# EAGLE design 1_Channel (EAGLE 9.5.2)
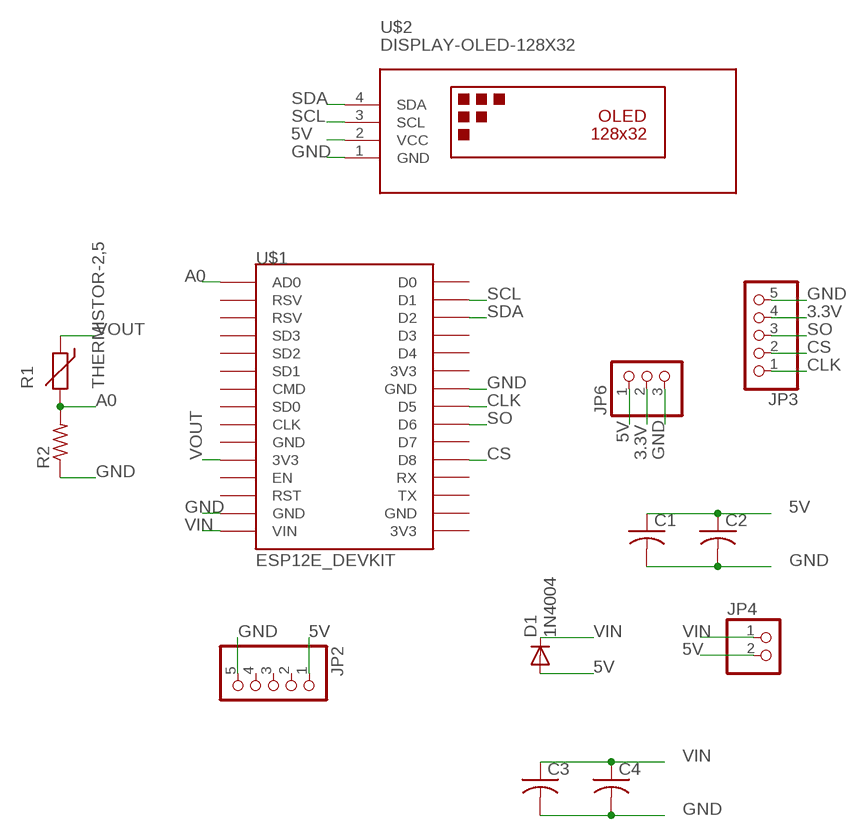
[diagram p0: schematic, sheet 1]

## Parts
C1  C-US050-025X075  [C050-025X075]
C2  C-US050-025X075  [C050-025X075]
C3  C-US050-025X075  [C050-025X075]
C4  C-US050-025X075  [C050-025X075]
D1  1N4004  [DO41-10]
JP2  PINHD-1X5  [1X05]
JP3  PINHD-1X5  [1X05]
JP4  PINHD-1X2  [1X02]
JP6  PINHD-1X3CB  [1X03-CLEANBIG]
R1  THERMISTOR-2,5  [RS-2,5]
R2  R-US_0207/7  [0207/7]
U$1  ESP12E_DEVKIT  [ESP12E_DEVKIT]
U$2  DISPLAY-OLED-128X32  [DISPLAY-OLED-128X32]

## Nets
3.3V: JP3.4 JP6.2
5V: C1.1 C2.1 D1.A JP2.1 JP4.2 JP6.1 U$2.2(VCC)
A0: R1.2 R2.2 U$1.AD0
CLK: JP3.1 U$1.D5
CS: JP3.2 U$1.D8
GND: C1.2 C2.2 C3.2 C4.2 JP2.5 JP3.5 JP6.3 R2.1 U$1.GND@1(GND) U$1.GND@2(GND) U$2.1(GND)
SCL: U$1.D1 U$2.3(SCL)
SDA: U$1.D2 U$2.4(SDA)
SO: JP3.3 U$1.D6
VIN: C3.1 C4.1 D1.C JP4.1 U$1.VIN
VOUT: R1.1 U$1.3V3@0(3V3)
Unconnected: JP2.2 JP2.3 JP2.4 U$1.3V3@1(3V3) U$1.3V3@2(3V3) U$1.CLK U$1.CMD U$1.D0 U$1.D3 U$1.D4 U$1.D7 U$1.EN U$1.GND@0(GND) U$1.GND@3(GND) U$1.RST U$1.RSV@0(RSV) U$1.RSV@1(RSV) U$1.RX U$1.SD0 U$1.SD1 U$1.SD2 U$1.SD3 U$1.TX

## Library data of the parts
C1-C4 = adafruit:C-US: CAPACITOR, American symbol
D1 = adafruit:1N4004: DIODE General purpose 1N400x type rectifier (With bigger pads) http://www.ladyada.net/library/pcb/eaglelibrary.html
JP2 JP3 = pinhead:PINHD-1X5: PIN HEADER
JP4 = pinhead:PINHD-1X2: PIN HEADER
JP6 = adafruit:PINHD-1X3: PIN HEADER
R1 = varistor:THERMISTOR: THERMISTOR
R2 = adafruit:R-US_: RESISTOR, American symbol
U$1 = ESP12E_DEVKIT:ESP12E_DEVKIT: ESP12E DEVKIT BOARD
U$2 = diy-modules:DISPLAY-OLED-128X32: 128x32 Dot Matrix OLED Module with I2C interface based on SSD1306 chip More details available here: http://www.tinyosshop.com/index.php?route=product/product&product_id=953 Schematic available here: http://www.tinyosshop.com/datasheet/OLED%2012832.pdf SSD1306 datasheet: https://cdn-shop.adafruit.com/datasheets/SSD1306.pdf Click here to find device on ebay.com <http://www.ebay.com/sch/oled+display+128x32+i2c>

## Board
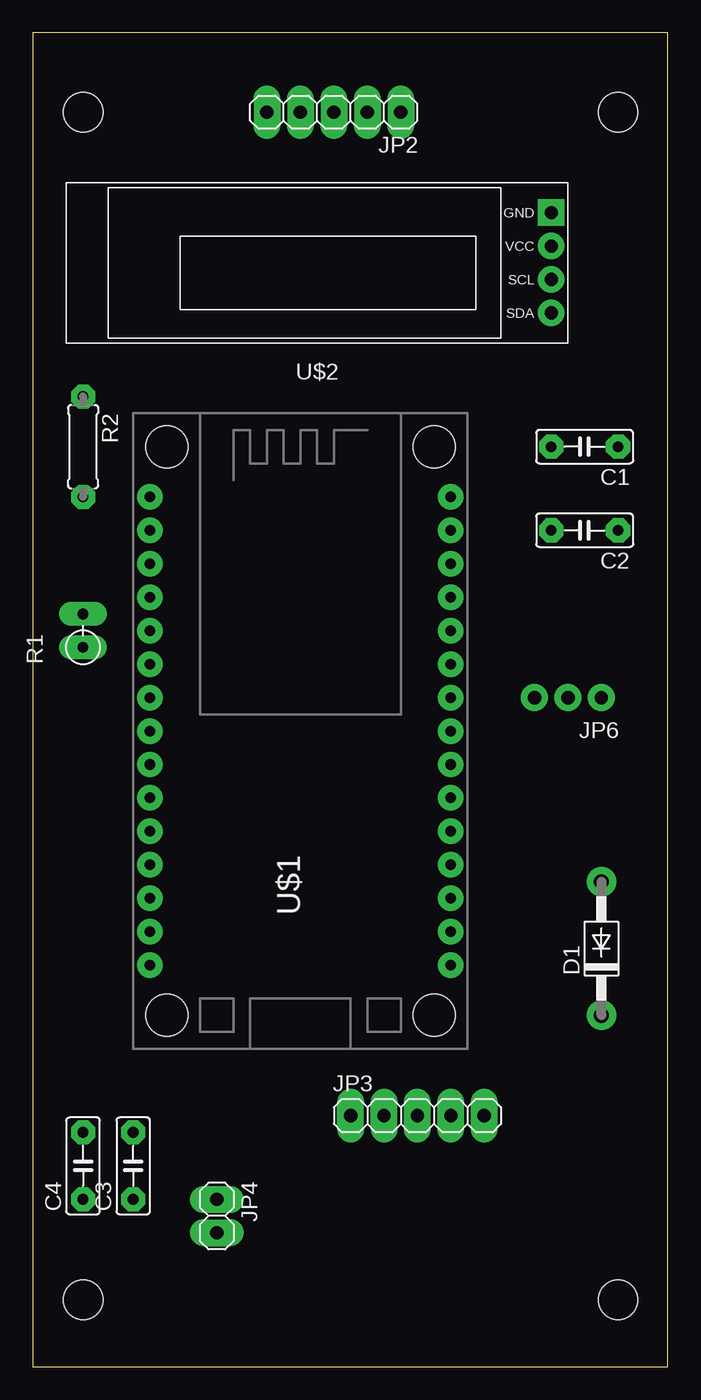
[diagram p1: board, top side]
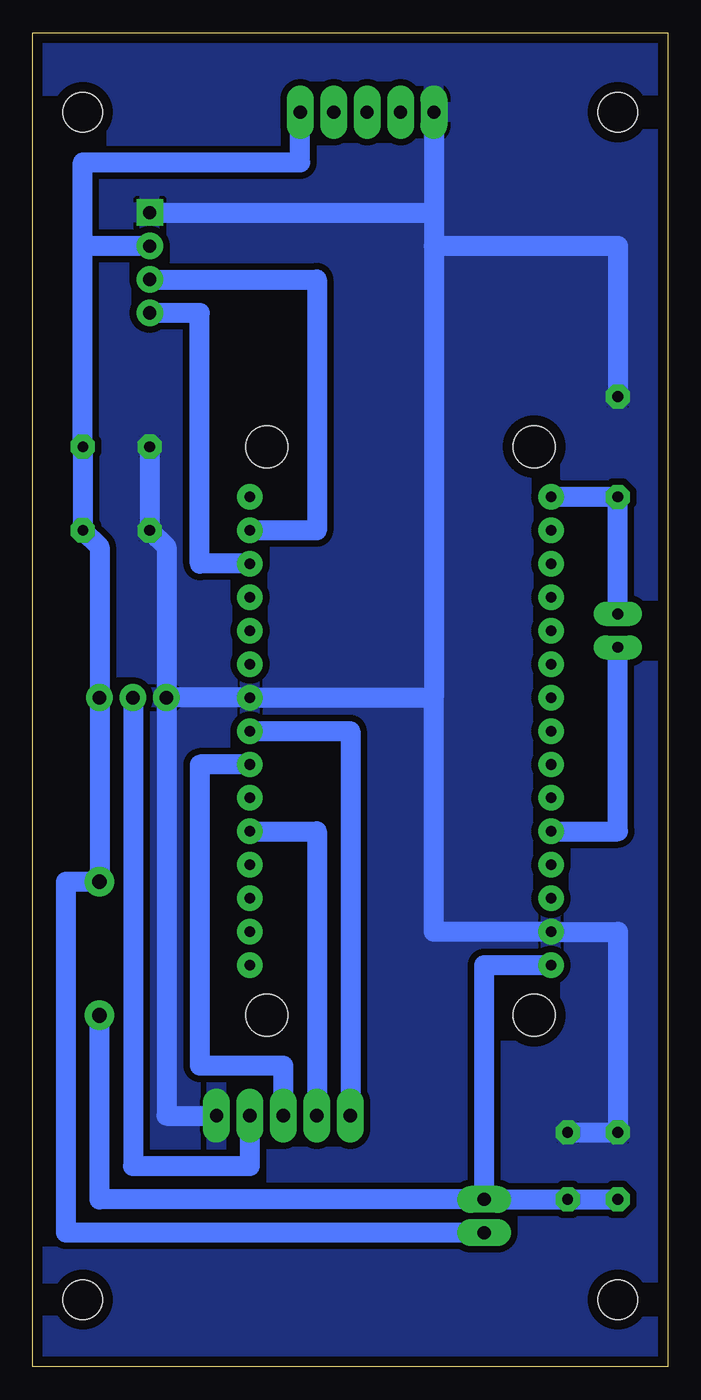
[diagram p2: board, bottom side, seen from below]

Size 48.24 x 101.27 mm. Coordinates in mm from the lower left corner, seen from the top.
Outline: 0,0 48.24,0 48.24,101.27 0,101.27 0,0
Copper layers (1*16): Top 0.035mm / dielectric 1.5mm / Bottom 0.035mm
Design rules "Old *": minimum track width 1.5mm, minimum drill 1mm, track to track 20mil, track to pad 20mil, pad to pad 20mil, via to via 16mil, smd to smd 6mil, copper to edge 30mil, drill to drill 6mil, minimum pad ring 20mil, minimum via ring 8mil, stop-mask expansion 4mil, vias tented up to drill 0mil, thermal gap 10mil
Holes 3 mm at 3.81,95.25 44.45,95.25 3.81,5.08 44.45,5.08

### Footprints (pad centres in the part's own frame; a part is rotated, then mirrored left to right if it is on the bottom)
C050-025X075 = drill 0.813 octagon: 1 -2.54,0; 2 2.54,0
DO41-10 = drill 1.118 pad 1.93: A 5.08,0; C -5.08,0
1X05 = drill 1.016 long: 1 -5.08,0; 2 -2.54,0; 3 0,0; 4 2.54,0; 5 5.08,0
1X02 = drill 1.016 long: 1 -1.27,0; 2 1.27,0
1X03-CLEANBIG = drill 1.016 pad 1.676: 1 -2.54,0; 2 0,0; 3 2.54,0
RS-2,5 = drill 0.813 long: 1 -1.27,0; 2 1.27,0
0207/7 = drill 0.813 octagon: 1 -3.81,0; 2 3.81,0
ESP12E_DEVKIT = drill 0.8 pad 1.93: 3V3@0 -11.43,-7.62; 3V3@1 11.43,5.08; 3V3@2 11.43,-17.78; AD0 -11.43,17.78; CLK -11.43,-2.54; CMD -11.43,2.54; D0 11.43,17.78; D1 11.43,15.24; D2 11.43,12.7; D3 11.43,10.16; D4 11.43,7.62; D5 11.43,0; D6 11.43,-2.54; D7 11.43,-5.08; D8 11.43,-7.62; EN -11.43,-10.16; GND@0 -11.43,-5.08; GND@1 -11.43,-15.24; GND@2 11.43,2.54; GND@3 11.43,-15.24; RST -11.43,-12.7; RSV@0 -11.43,15.24; RSV@1 -11.43,12.7; RX 11.43,-10.16; SD0 -11.43,0; SD1 -11.43,5.08; SD2 -11.43,7.62; SD3 -11.43,10.16; TX 11.43,-12.7; VIN -11.43,-17.78 | hole 3.2: -10.16,21.59; 10.16,21.59; 10.16,-21.59; -10.16,-21.59
DISPLAY-OLED-128X32 = drill 1 square: 1 -17.78,-3.81 | drill 1: 2 -17.78,-1.27; 3 -17.78,1.27; 4 -17.78,3.81

### Placement (x,y rotation side)
C1  41.91,69.85 180 top
C2  41.91,63.5 180 top
C3  7.62,15.24 90 top
C4  3.81,15.24 90 top
D1  43.18,31.75 90 top
JP2  22.86,95.25 180 top
JP3  29.21,19.05 0 top
JP4  13.97,11.43 270 top
JP6  40.64,50.8 180 top
R1  3.81,55.88 90 top
R2  3.81,69.85 270 top
U$1  20.32,48.26 0 top
U$2  21.59,83.82 180 top

### Tracks (layer width: path | path; a pad name or v marks a point on that pad's centre or on a via)
3.3V
  Bottom 1.5: JP3.4 31.75,15.24 40.64,15.24 JP6.2
5V
  Bottom 1.5: U$2.2 44.45,85.09 | 44.45,85.09 C1.1 C2.1 43.18,62.23 JP6.1 D1.A 45.72,36.83 45.72,10.16 JP4.2 | 44.45,85.09 44.45,91.44 27.94,91.44 JP2.1
A0
  Bottom 1.5: R1.2 R2.2 U$1.AD0
CLK
  Bottom 1.5: U$1.D5 24.13,48.26 JP3.1
CS
  Bottom 1.5: JP3.2 26.67,40.64 U$1.D8
GND
  Bottom 1.5: 17.78,50.8 17.78,33.02 U$1.GND@1 3.81,33.02 C4.2 C3.2 | 17.78,50.8 U$1.GND@2 JP6.3 | JP6.3 38.1,19.05 JP3.5 | 17.78,85.09 3.81,85.09 R2.1 | U$2.1 17.78,87.63 | JP2.5 17.78,87.63 | 17.78,87.63 17.78,85.09 | JP6.3 38.1,62.23 C2.2 C1.2 | 17.78,85.09 17.78,50.8
  pour Bottom: 0,101.6 48.26,101.6 48.26,0 0,0
SCL
  Bottom 1.5: U$2.3 26.67,82.55 26.67,63.5 U$1.D1
SDA
  Bottom 1.5: U$2.4 35.56,80.01 35.56,60.96 U$1.D2
SO
  Bottom 1.5: JP3.3 29.21,22.86 35.56,22.86 35.56,45.72 U$1.D6
VIN
  Bottom 1.5: U$1.VIN 13.97,30.48 JP4.1 | JP4.1 43.18,12.7 D1.C | C4.1 C3.1 JP4.1
VOUT
  Bottom 1.5: U$1.3V3@0 3.81,40.64 R1.1